# EAGLE design RTC-zero-SHIM (EAGLE 9.6.2)
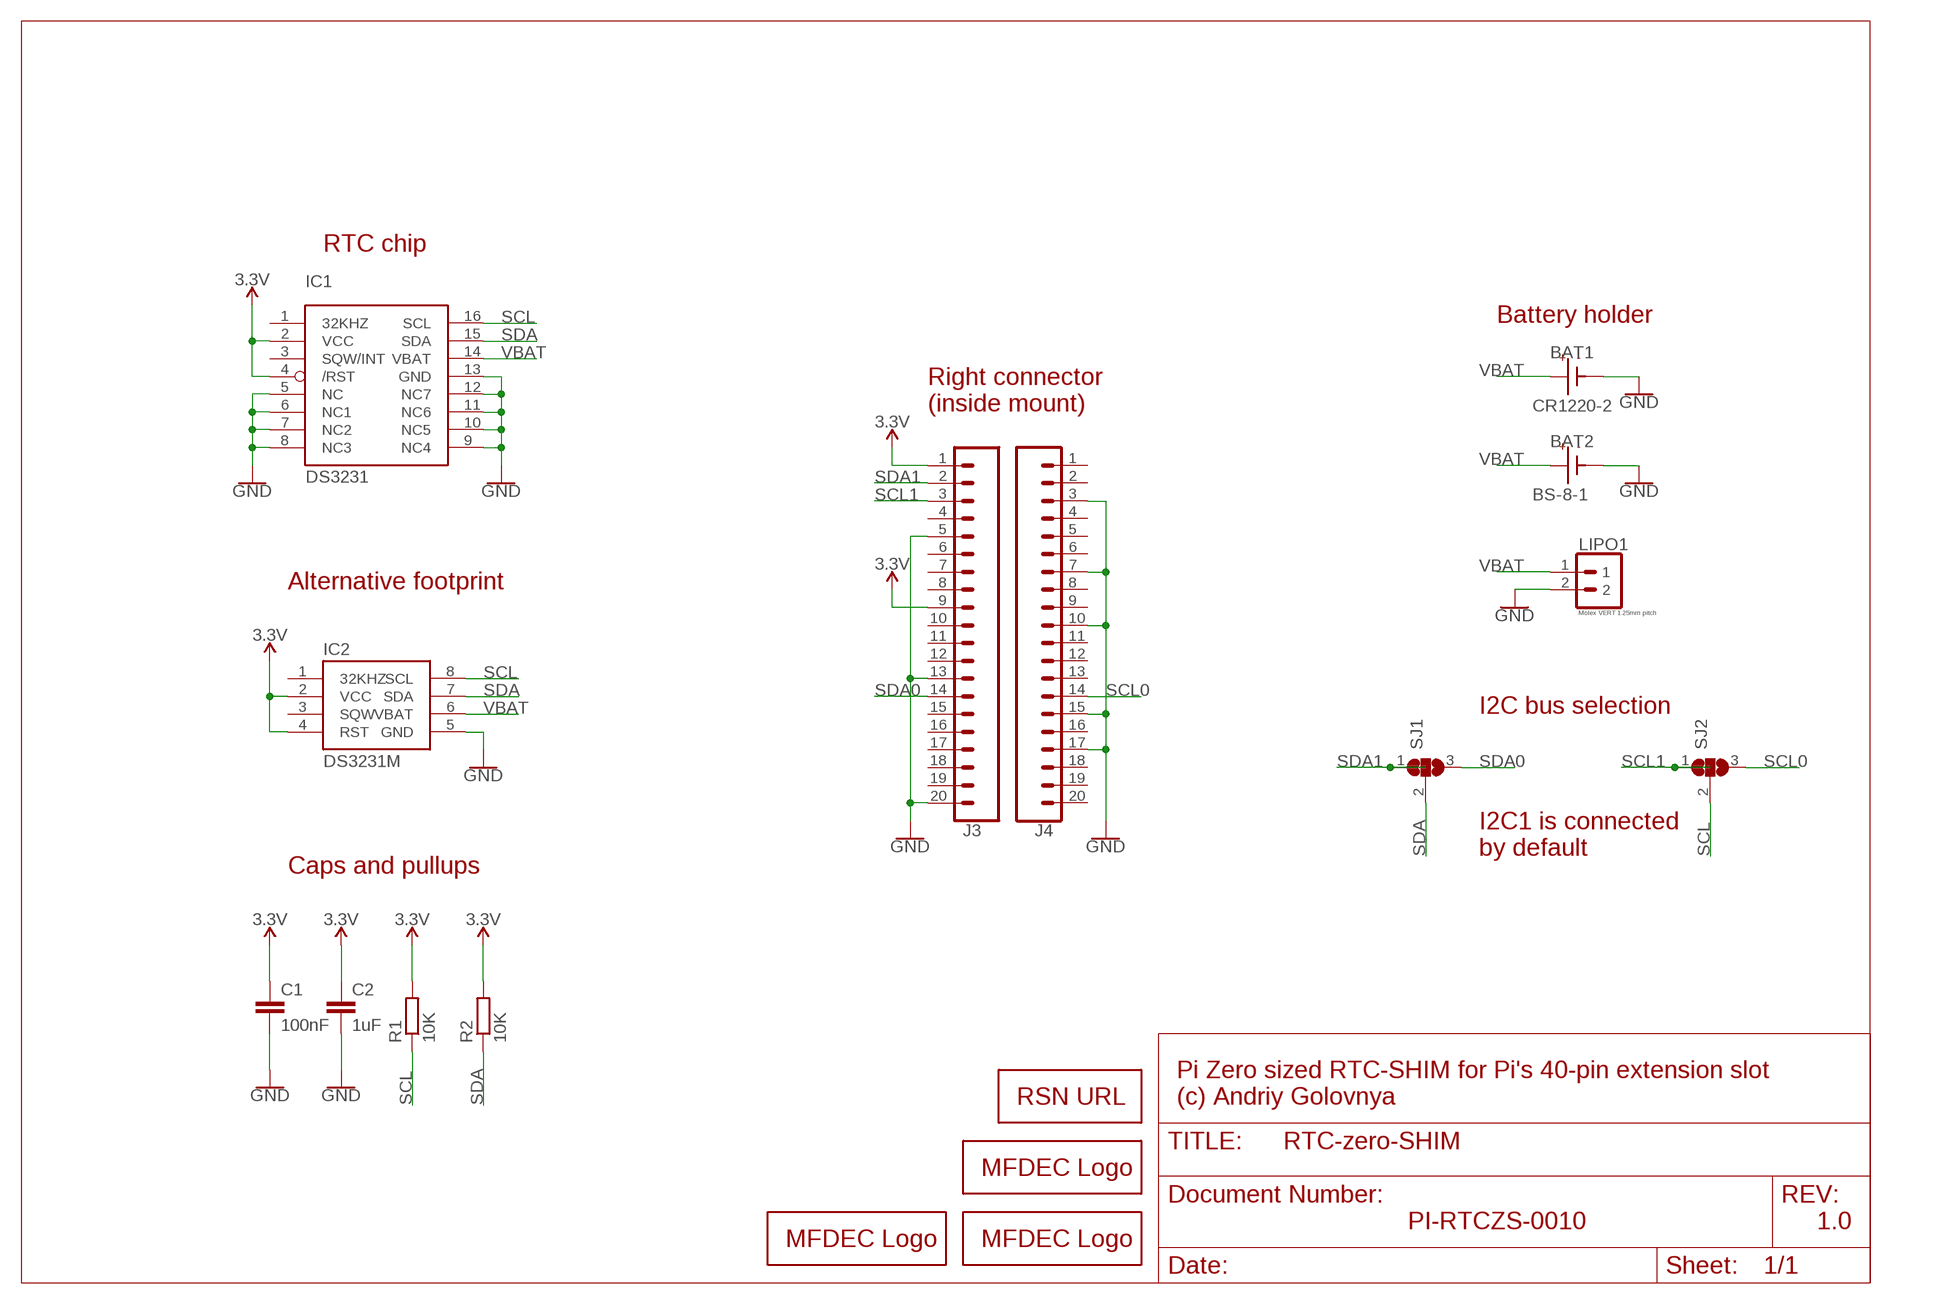
[diagram p0: schematic, sheet 1]

## Parts
BAT1  CR1220-2  [CR1220-2]
BAT2  BS-8-1  [BS-8-1]
C1  100nF  C-EUC0402  [C0402]
C2  1uF  C-EUC0603  [C0603]
IC1  DS3231/SO  [SO16W]
IC2  DS3231M  [SO08]
J3  CONN_20LOCK  [1X20_LOCK]
J4  CONN_20LOCK  [1X20_LOCK]
LIPO1  Molex VERT 1.25mm pitch  1X02_MOLEX_0530470210_VERT-MALE_PITCH-1.25MM  [_MOLEX-0530470210_VERT_PITCH-1.25MM]
LOGO1  MFDECLOGO_SQ_8MM  [MFDEC_SQ_8MM]
LOGO2  MFDECLOGO_L_30MM  [MFDEC_L_30MM]
LOGO3  RSNURL_QR_10MM  [RSNURL_QR_10MM]
LOGO4  MFDECLOGO_L_10MM  [MFDEC_L_10MM]
R1  10K  R-EU_R0402  [R0402]
R2  10K  R-EU_R0402  [R0402]
SJ1  SJ2  [SJ_2]
SJ2  SJ2  [SJ_2]

## Nets
3.3V: C1.1 C2.1 IC1.2(VCC) IC1.4(/RST) IC2.2(VCC) IC2.4(RST) J3.1 J3.9 R1.2 R2.2
GND: BAT1.BAT- BAT2.BAT- C1.2 C2.2 IC1.5(NC) IC1.6(NC1) IC1.7(NC2) IC1.8(NC3) IC1.9(NC4) IC1.10(NC5) IC1.11(NC6) IC1.12(NC7) IC1.13(GND) IC2.5(GND) J3.5 J3.13 J3.20 J4.3 J4.7 J4.10 J4.15 J4.17 LIPO1.2
SCL: IC1.16(SCL) IC2.8(SCL) R1.1 SJ2.2
SCL0: J4.14 SJ2.3
SCL1: J3.3 SJ2.1
SDA: IC1.15(SDA) IC2.7(SDA) R2.1 SJ1.2
SDA0: J3.14 SJ1.3
SDA1: J3.2 SJ1.1
VBAT: BAT1.BAT+ BAT2.BAT+ IC1.14(VBAT) IC2.6(VBAT) LIPO1.1
Unconnected: IC1.1(32KHZ) IC1.3(SQW/INT) IC2.1(32KHZ) IC2.3(SQW) J3.4 J3.6 J3.7 J3.8 J3.10 J3.11 J3.12 J3.15 J3.16 J3.17 J3.18 J3.19 J4.1 J4.2 J4.4 J4.5 J4.6 J4.8 J4.9 J4.11 J4.12 J4.13 J4.16 J4.18 J4.19 J4.20

## Notes on the sheet
- RTC chip
- Battery holder
- Right connector
  (inside mount)
- Alternative footprint
- I2C bus selection
- I2C1 is connected
  by default
- Caps and pullups
- Pi Zero sized RTC-SHIM for Pi's 40-pin extension slot
  (c) Andriy Golovnya
- PI-RTCZS-0010 | 1.0

## Library data of the parts
BAT1 = CR1220-2:CR1220-2
BAT2 = BS-8-1:BS-8-1
C1 C2 = rcl:C-EU: CAPACITOR, European symbol; SPICEPREFIX: C
IC1 = adafruit:DS3231
IC2 = SparkFun-Clocks:DS3231M: DS3231M Real Time Clock Accuracy +/-5ppm. Battery Backup. 2.3V to 5.5V. Datasheet <https://cdn.sparkfun.com/datasheets/Dev/Beagle/DS3231M.pdf> SparkFun Products CryptoCape <https://www.sparkfun.com/products/12773> (DEV-12773) SparkFun CryptoShield <https://www.sparkfun.com/products/13183> (DEV-13183); PROD_ID: IC-11985
J3 J4 = _my_locked_connectors:CONN_20: Multi connection point. Often used as Generic Header-pin footprint for 0.1 inch spaced/style header connections On any of the 0.1 inch spaced packages, you can populate with these: Break Away Headers - Straight <https://www.sparkfun.com/products/116> (PRT-00116) Break Away Male Headers - Right Angle <https://www.sparkfun.com/products/553> (PRT-00553) Female Headers <https://www.sparkfun.com/products/115> (PRT-00115) Break Away Headers - Machine Pin <https://www.sparkfun.com/products/117> (PRT-00117) Break Away Female Headers - Swiss Machine Pin <https://www.sparkfun.com/products/743> (PRT-00743) For SCREWTERMINALS and SPRING TERMINALS visit here: Screw Terimnals on SparkFun.com <https://www.sparkfun.com/search/results?term=Screw+Terminals> (5mm/3.5mm/2.54mm spacing) This device is also useful as a general connection point to wire up your design to another part of your project. Our various solder wires solder well into these plated through hole pads. Hook-Up Wire - Assortment (Stranded, 22 AWG) <https://www.sparkfun.com/products/11375> (PRT-11375) Hook-Up Wire - Assortment (Solid Core, 22 AWG) <https://www.sparkfun.com/products/11367> (PRT-11367) View the entire wire category on our website here <https://www.sparkfun.com/categories/141> Special notes: Molex polarized connector foot print use with SKU : PRT-08231 with associated crimp pins and housings. 1MM SMD Version SKU: PRT-10208 NOTES ON THE VARIANTS LOCK and LOCK_LONGPADS... This footprint was designed to help hold the alignment of a through-hole component (i.e. 6-pin header) while soldering it into place. You may notice that each hole has been shifted either up or down by 0.005 of an inch from it's more standard position (which is a perfectly straight line). This slight alteration caused the pins (the squares in the middle) to touch the edges of the holes. Because they are alternating, it causes a "brace" to hold the component in place. 0.005 has proven to be the perfect amount of "off-center" position when using our standard breakaway headers. Although looks a little odd when you look at the bare footprint, once you have a header in there, the alteration is very hard to notice. Also,if you push a header all the way into place, it is covered up entirely on the bottom side. Note about LOCK SPECIAL package: This is just like the LOCK variant in that the holes are staggared by 5 mil, but except for the last two holes. They are not altered from the "standard" footprint layout. This is used for a special purpose on the layout of our Graphic LCD Backpack. Make sure you want to use this device before selecting it for you project!
LIPO1 = PiB_connectors:1X02_MOLEX; DATASHEET_CONNECTOR1: https://www.molex.com/pdm_docs/sd/530470210_sd.pdf; DATASHEET_CONNECTOR2: https://www.molex.com/pdm_docs/sd/510210700_sd.pdf; DATASHEET_CRIMP: https://www.molex.com/pdm_docs/sd/500798000_sd.pdf; DISTLINK_CONNECTOR1: https://www.digikey.com/products/en?keywords=WM1731-ND; DISTLINK_CONNECTOR2: https://www.digikey.com/products/en?keywords=WM1720-ND; DISTLINK_CRIMP: https://www.digikey.com/products/en?keywords=WM1142CT-ND; DISTPN_CONNECTOR1: WM1731-ND; DISTPN_CONNECTOR2: WM1720-ND; DISTPN_CRIMP: WM1142CT-ND; DIST_CONNECTOR1: Digikey; DIST_CONNECTOR2: Digikey; DIST_CRIMP: Digikey; MFR_CONNECTOR1: Molex, LLC; MFR_CONNECTOR2: Molex, LLC; MFR_CRIMP: Molex, LLC; MPN_CONNECTOR1: 0530470210; MPN_CONNECTOR2: 51021-0200; MPN_CRIMP: 0500798000
LOGO1 LOGO2 LOGO4 = _my_logos:MFDECLOGO: Midnight Fog - Digital Eye Candy LOGO
LOGO3 = _my_logos:RSNURL: RedScorp.Net URL
R1 R2 = rcl:R-EU_: RESISTOR, European symbol; SPICEPREFIX: R
SJ1 SJ2 = _my_jumpers:SJ2: SMD solder JUMPER SJ2 - simple jumper SJ2FI - fancy inside jumper SJ2FO - fancy outside jumper SJ2FL - fancy left jumper SJ2FR - fancy right jumper SJ2W - wide jumper

## Board
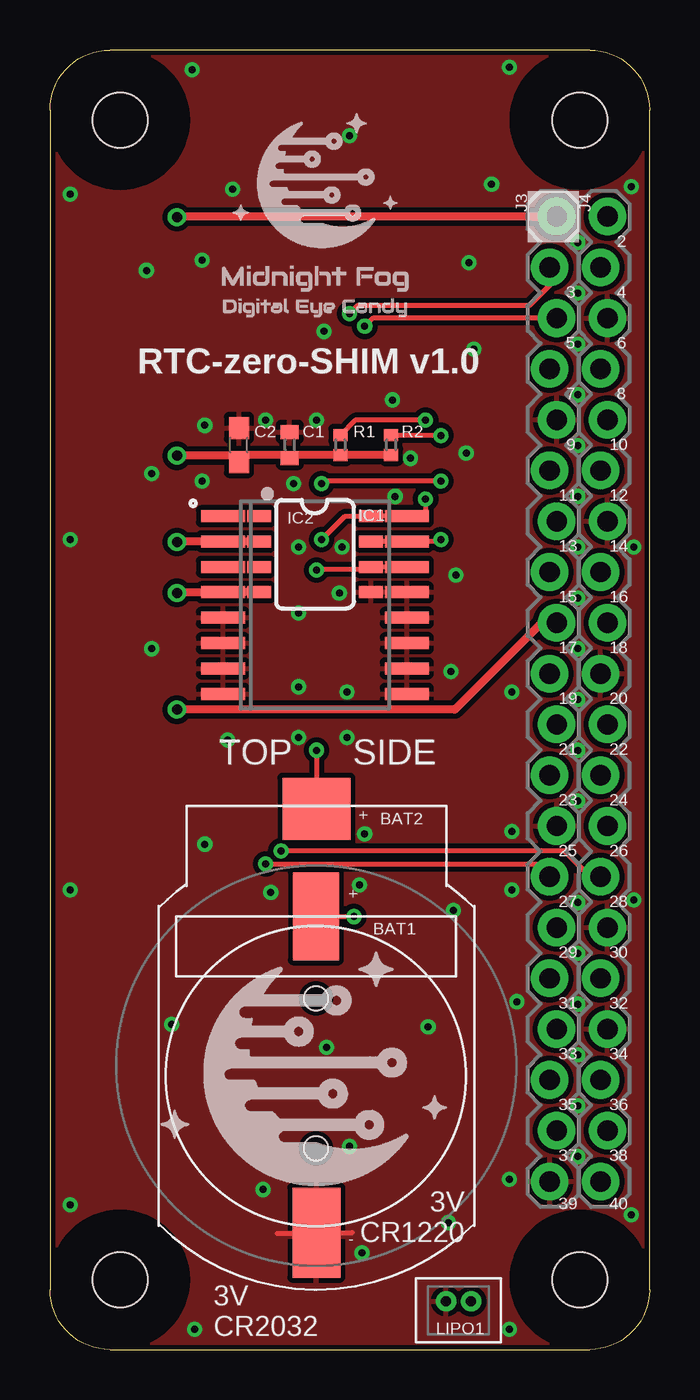
[diagram p1: board, top side]
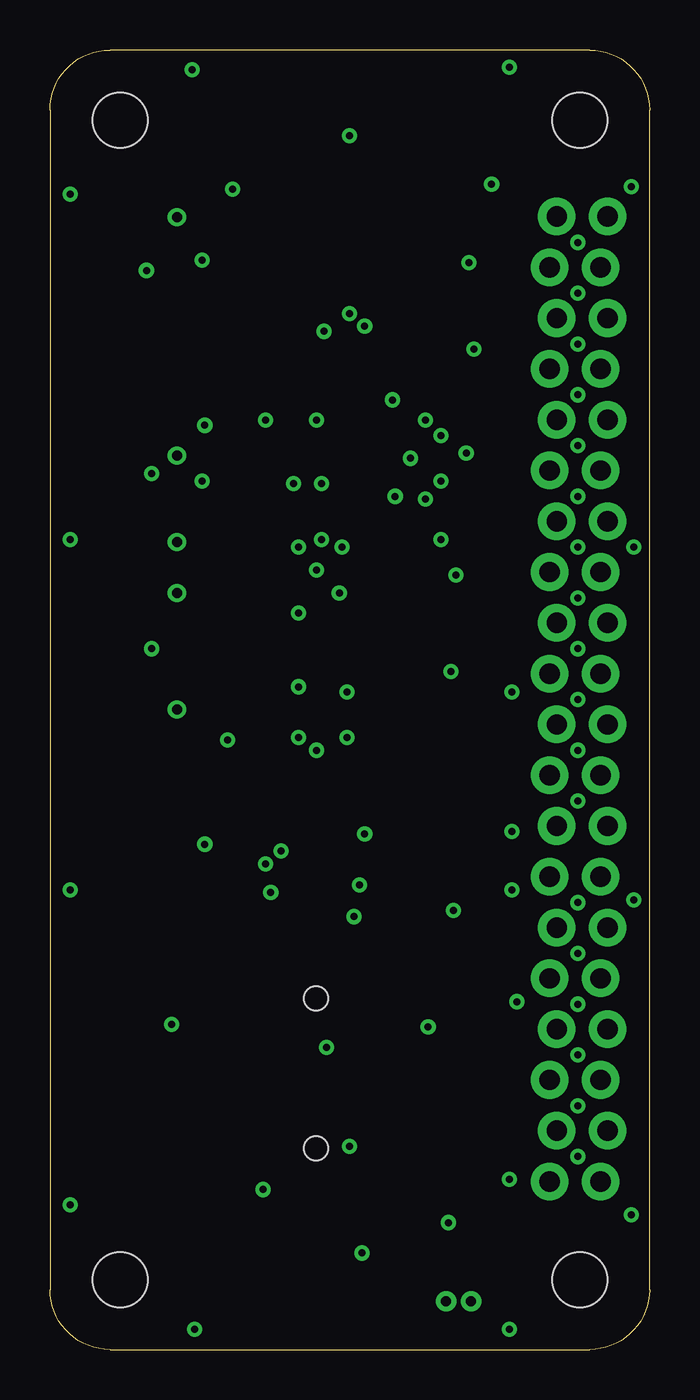
[diagram p2: board, inner layer Route2]
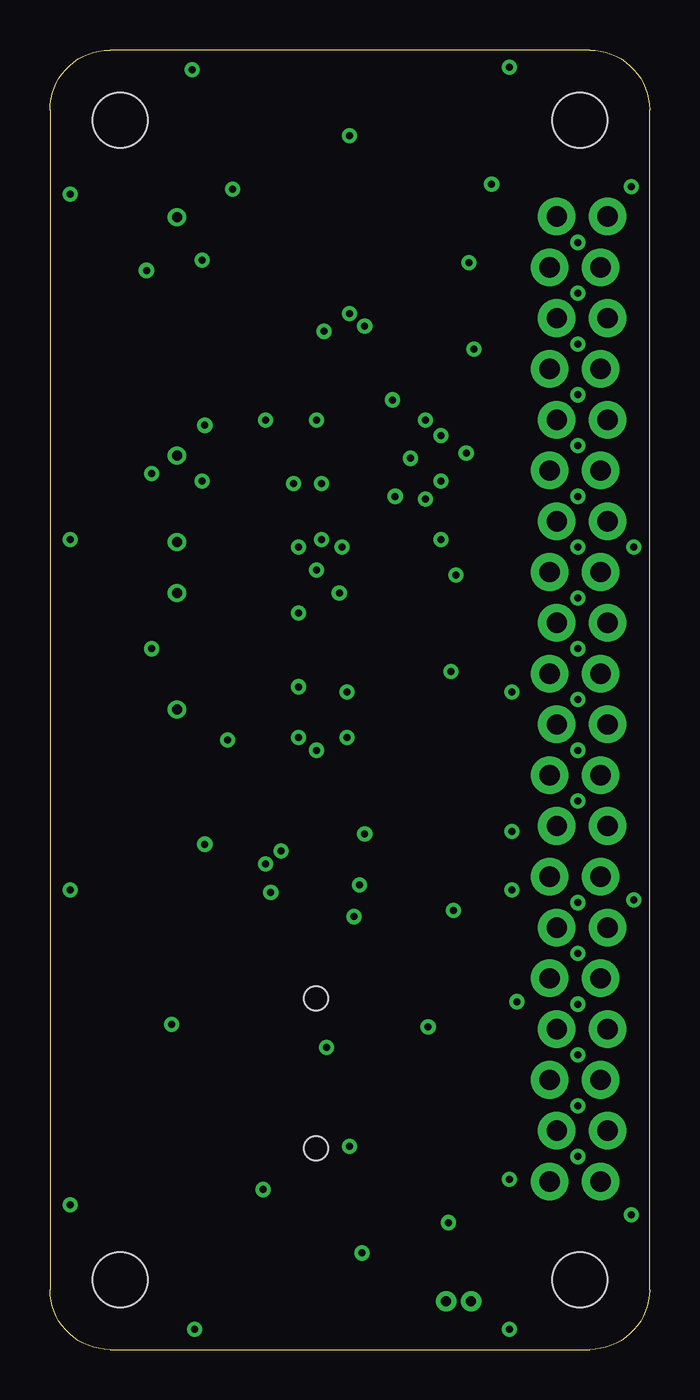
[diagram p3: board, inner layer Route15]
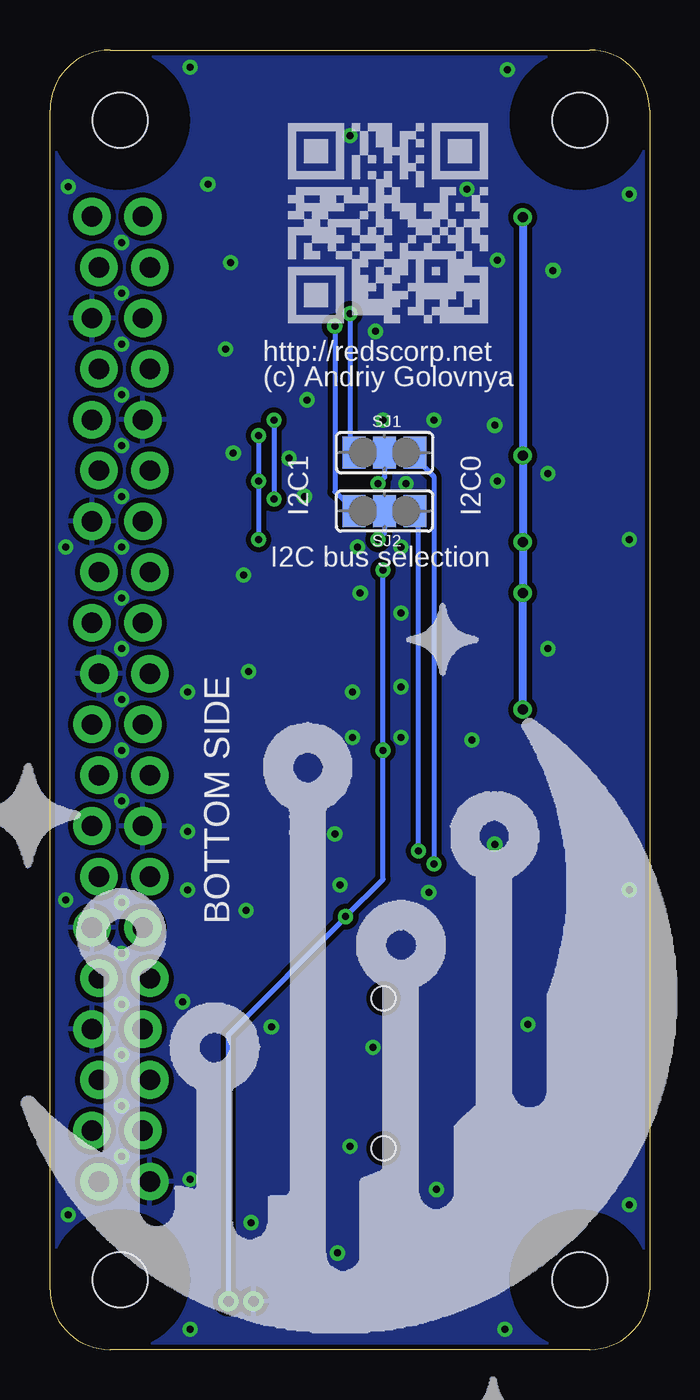
[diagram p4: board, bottom side, seen from below]

Size 30 x 65 mm. Coordinates in mm from the lower left corner, seen from the top.
Outline: 3,0 27,0 arc90 30,3 30,62 arc90 27,65 3,65 arc90 0,62 0,3 arc90 3,0
Copper layers (1*16): Top 0.035mm / dielectric 1.5mm / Bottom 0.035mm
Design rules "default *": minimum track width 6mil, minimum drill 0.35mm, track to track 6mil, track to pad 6mil, pad to pad 6mil, via to via 6mil, smd to smd 6mil, copper to edge 6mil, drill to drill 6mil, minimum pad ring 10mil, minimum via ring 8mil, stop-mask expansion 4mil, vias tented up to drill 20mil, thermal gap 10mil
Holes 2.75 mm at 3.5,3.5 26.5,3.5 3.5,61.5 26.5,61.5

### Footprints (pad centres in the part's own frame; a part is rotated, then mirrored left to right if it is on the bottom)
CR1220-2 = smd 2.3 x 4.4: BAT+ 0,-8 | smd 2.3 x 4: BAT- 0,8 | hole 1.2: 0,3.6; 0,-3.9
BS-8-1 = smd 3.4 x 3.1: BAT+ 0,-12.85 | smd 2.4 x 4.5: BAT- 0,8.35
C0402 = smd 0.7 x 0.9: 1 -0.65,0; 2 0.65,0
C0603 = smd 1.1 x 1: 1 -0.85,0; 2 0.85,0
SO16W = smd 0.6 x 2.2: 1 -4.445,-4.6; 2 -3.175,-4.6; 3 -1.905,-4.6; 4 -0.635,-4.6; 5 0.635,-4.6; 6 1.905,-4.6; 7 3.175,-4.6; 8 4.445,-4.6; 9 4.445,4.6; 10 3.175,4.6; 11 1.905,4.6; 12 0.635,4.6; 13 -0.635,4.6; 14 -1.905,4.6; 15 -3.175,4.6; 16 -4.445,4.6
SO08 = smd 0.6 x 1.2: 1 -1.905,-2.8; 2 -0.635,-2.8; 3 0.635,-2.8; 4 1.905,-2.8; 5 1.905,2.8; 6 0.635,2.8; 7 -0.635,2.8; 8 -1.905,2.8
1X20_LOCK = drill 1.016 pad 1.88: 1 0,0.178; 2 2.54,-0.178; 3 5.08,0.178; 4 7.62,-0.178; 5 10.16,0.178; 6 12.7,-0.178; 7 15.24,0.178; 8 17.78,-0.178; 9 20.32,0.178; 10 22.86,-0.178; 11 25.4,0.178; 12 27.94,-0.178; 13 30.48,0.178; 14 33.02,-0.178; 15 35.56,0.178; 16 38.1,-0.178; 17 40.64,0.178; 18 43.18,-0.178; 19 45.72,0.178; 20 48.26,-0.178
_MOLEX-0530470210_VERT_PITCH-1.25MM = drill 0.5: 1 -0.625,0; 2 0.625,0
R0402 = smd 0.6 x 0.7: 1 -0.5,0; 2 0.5,0
SJ_2 = smd 1.168 x 1.6: 1 -1.524,0; 2 0,0; 3 1.524,0

### Placement (x,y rotation side)
BAT1  13.31,13.67 180 top
BAT2  13.34,14.19 180 top
C1  11.99,45.24 90 top
C2  9.45,45.24 90 top
IC1  13.26,37.24 270 top
IC2  13.26,39.78 270 top
J3  25.18,56.67 270 top
J4  27.72,56.67 270 top
LIPO1  20.45,2.41 180 top
LOGO1  7.93,51.34 0 top
LOGO2  -4.14,-7.97 90 bottom  (outside the outline)
LOGO3  18.09,51.34 0 bottom
LOGO4  4.75,7.27 0 top
R1  14.53,45.24 270 top
R2  17.07,45.24 270 top
SJ1  13.26,44.86 0 bottom
SJ2  13.26,41.94 0 bottom

### Tracks (layer width: path | path; a pad name or v marks a point on that pad's centre or on a via)
3.3V  (via drill 0.5)
  Top 0.406: IC2.2 IC1.2 6.38,40.42 v6.35,40.39 | IC2.4 IC1.4 6.38,37.88 v6.35,37.85 | R2.2 R1.2 12.14,44.74 C1.1 11.84,44.74 9.8,44.74 C2.1 9.14,44.7 v6.35,44.7 | J3.1 6.38,56.67 v6.35,56.64 | J3.9 24.6,36.35 20.25,32 v6.35,32
  Bottom 0.406: v6.35,56.64 v6.35,44.7 v6.35,40.39 v6.35,37.85 v6.35,32
GND  (via drill 0.35)
  Top 0.254: 15.11,5.84 13.49,5.84 BAT1.BAT- 13.18,5.79 11.38,5.79
  other vias: 26.42,55.37 26.42,52.83 26.42,50.29 26.42,47.75 26.42,45.21 26.42,42.67 26.42,40.13 26.42,35.05 26.42,37.59 26.42,32.51 26.42,29.97 26.42,27.43 26.42,22.35 26.42,19.81 26.42,17.27 26.42,14.73 26.42,12.19 26.42,9.65 29.08,6.73 29.08,58.17 7.11,64.01 22.99,64.14 1.02,57.78 1.02,7.24 7.24,1.02 22.99,1.02 12.45,40.13 14.61,40.13 14.48,37.85 12.45,33.15 12.45,30.61 14.86,30.61 14.86,32.89 20.07,33.91 23.11,32.89 18.03,44.58 17.27,42.67 12.19,43.31 13.34,46.48 10.79,46.48 7.75,46.23 7.62,43.43 5.08,43.81 5.08,35.05 12.45,36.83 17.14,47.5 20.83,44.83 20.32,38.73 19.94,6.35 10.67,8 14.99,10.16 15.62,4.83 1.02,40.51 1.02,22.99 29.21,22.48 29.21,40.13 8.89,30.48 7.75,25.27 15.49,23.24 15.75,25.78 23.11,22.99 23.11,25.91 20.95,54.36 21.21,50.04 22.1,58.29 9.14,58.04 7.62,54.48 4.83,53.98 13.72,50.93 14.99,60.71 6.1,16.26 18.92,16.13 22.99,8.51 23.37,17.4 20.19,21.97 13.84,15.11 11.05,22.86
  pour Top (isolate 0.254): 0,0.01 0,65.01 39.19,65.01 39.19,0.01
  pour Bottom (isolate 0.254): 0.02,0.01 0.02,65 34.68,65 34.68,0.01
GND1
  cutout Top: 3.5,58 arc-180 3.5,65 arc-180
  cutout Route2: 3.5,58 arc-180 3.5,65 arc-180
  cutout Route15: 3.5,58 arc-180 3.5,65 arc-180
  cutout Bottom: 3.5,58 arc-180 3.5,65 arc-180
GND2
  cutout Top: 26.5,58 arc-180 26.5,65 arc-180
  cutout Route2: 26.5,58 arc-180 26.5,65 arc-180
  cutout Route15: 26.5,58 arc-180 26.5,65 arc-180
  cutout Bottom: 26.5,58 arc-180 26.5,65 arc-180
GND3
  cutout Top: 3.5,0 arc-180 3.5,7 arc-180
  cutout Route2: 3.5,0 arc-180 3.5,7 arc-180
  cutout Route15: 3.5,0 arc-180 3.5,7 arc-180
  cutout Bottom: 3.5,0 arc-180 3.5,7 arc-180
GND4
  cutout Top: 26.5,0 arc-180 26.5,7 arc-180
  cutout Route2: 26.5,0 arc-180 26.5,7 arc-180
  cutout Route15: 26.5,0 arc-180 26.5,7 arc-180
  cutout Bottom: 26.5,0 arc-180 26.5,7 arc-180
SCL  (via drill 0.35)
  Top 0.254: v13.59,40.51 14.76,41.69 IC2.8 IC1.16 18.62,41.69 18.8,41.86 v18.8,42.55 | R1.1 15.27,46.48 v18.8,46.48
  Bottom 0.152: SJ2.2 13.29,41.91 14.23,41.91
  Bottom 0.254: SJ2.2 13.26,40.84 v13.59,40.51 | v18.8,46.48 v18.8,42.55
SCL0  (via drill 0.35)
  Top 0.254: J4.14 27.04,23.65 25.74,24.94 v11.56,24.94
  Bottom 0.254: v11.56,24.94 11.56,41.76 SJ2.3
SCL1  (via drill 0.35)
  Top 0.254: J3.3 16.15,51.59 v15.75,51.18
  Bottom 0.254: v15.75,51.18 15.75,42.9 SJ2.1
SDA  (via drill 0.35)
  Top 0.254: IC2.7 IC1.15 19.46,40.42 v19.56,40.51 | v19.56,43.43 13.72,43.43 v13.59,43.31 | R2.1 19.54,45.74 v19.56,45.72
  Bottom 0.152: SJ1.2 13.29,44.83 14.23,44.83
  Bottom 0.254: SJ1.2 13.26,43.63 v13.59,43.31 | v19.56,40.51 v19.56,43.43 v19.56,45.72
SDA0  (via drill 0.35)
  Top 0.254: v10.79,24.28 24.37,24.28 J3.14
  Bottom 0.254: SJ1.3 11.74,44.61 10.79,43.67 v10.79,24.28
SDA1  (via drill 0.35)
  Top 0.254: J3.2 25,53.24 23.99,52.22 15.39,52.22 v14.99,51.82
  Bottom 0.254: v14.99,51.82 14.99,45.06 SJ1.1
VBAT  (via drill 0.35)
  Top 0.254: IC1.14 IC2.6 15.93,39.02 13.37,39.02 v13.34,38.99 | v13.34,29.97 BAT2.BAT+ | BAT1.BAT+ 15.19,21.66 v15.21,21.65
  Bottom 0.254: v13.34,38.99 v13.34,29.97 13.34,23.52 v15.21,21.65 15.21,21.61 21.07,15.75 LIPO1.1

### Text on the board
tPlace: 2 | 3 | 4 | 5 | 6 | RTC-zero-SHIM v1.0 | 7 | 8 | 9 | 10 | 11 | 12 | 13 | 14 | 15 | 16 | 17 | 18 | 19 | 20 | 21 | 22 | TOP SIDE | 23 | 24 | + | 25 | 26 | + | 27 | 28 | 29 | 30 | 31 | 32 | 33 | 34 | 35 | 36 | 37 | 38 | 39 | 40 | - | 3V / CR1220 | 3V / CR2032
bPlace: http://redscorp.net | (c) Andriy Golovnya | I2C0 | I2C1 | I2C bus selection | BOTTOM SIDE